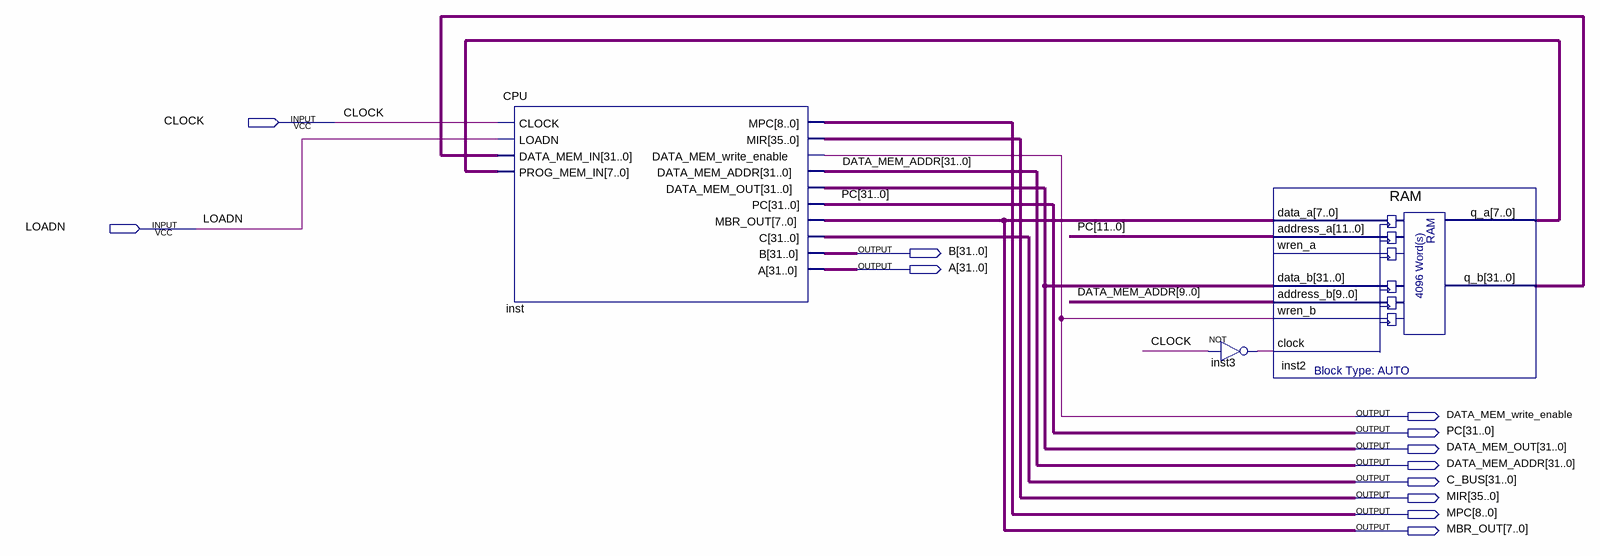
[diagram p0: schematic sheet]
// Quartus schematic MIC1_DEF.bdf as structural Verilog: 3 symbols, 12 pins
module MIC1_DEF (
  input  CLOCK,
  input  LOADN,
  output [31:0] B,
  output [31:0] A,
  output DATA_MEM_write_enable,
  output [31:0] PC,
  output [31:0] DATA_MEM_OUT,
  output [31:0] DATA_MEM_ADDR,
  output [31:0] C_BUS,
  output [35:0] MIR,
  output [8:0] MPC,
  output [7:0] MBR_OUT
);

  wire inst3_out;
  wire [7:0] inst2_q_a;
  wire [31:0] inst2_q_b;

  CPU inst (
    .CLOCK(CLOCK), .LOADN(LOADN), .DATA_MEM_IN(inst2_q_b), .PROG_MEM_IN(inst2_q_a), .MPC(MPC), .MIR(MIR),
    .DATA_MEM_write_enable(DATA_MEM_write_enable), .DATA_MEM_ADDR(DATA_MEM_ADDR),
    .DATA_MEM_OUT(DATA_MEM_OUT), .PC(PC), .MBR_OUT(MBR_OUT), .C(C_BUS), .B(B), .A(A));
  not inst3 (inst3_out, CLOCK);
  RAM inst2 (
    .data_a(MBR_OUT), .address_a(PC[11:0]), .data_b(DATA_MEM_OUT), .address_b(DATA_MEM_ADDR[9:0]),
    .wren_b(DATA_MEM_write_enable), .clock(inst3_out), .q_a(inst2_q_a), .q_b(inst2_q_b));  // open: wren_a
endmodule
